# Altium schematic sheet Voltage Regulation.SchDoc
size A; DocumentNumber: 4; SheetNumber: 4; SheetTotal: 4
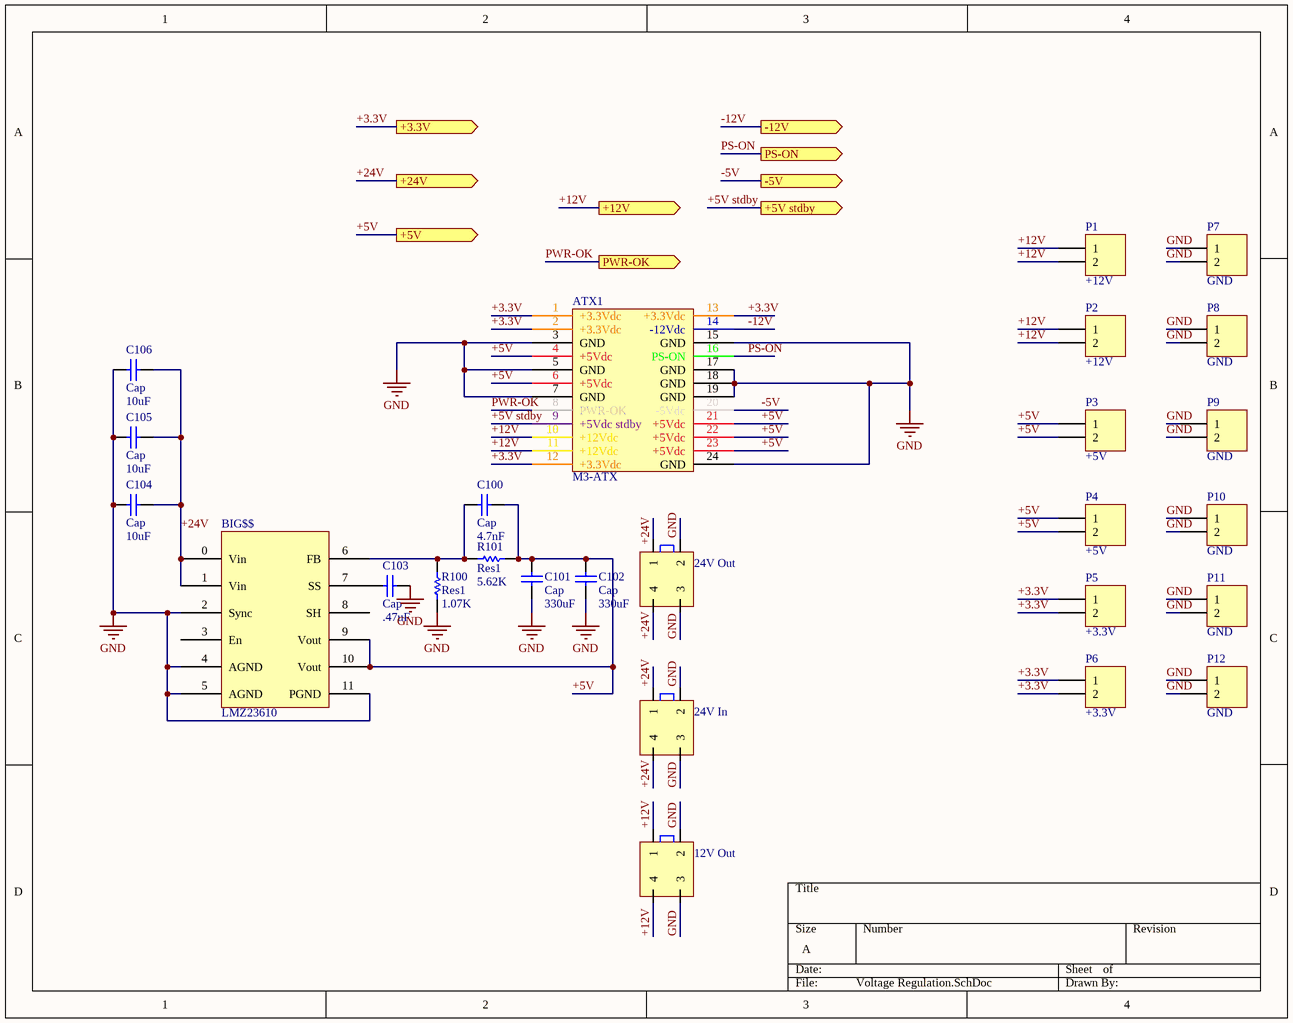
[diagram p0: Voltage Regulation.SchDoc]

## Parts
12V_Out  5566-4  [5566-4]  (value not drawn)
24V_In  5566-4  [5566-4]  (value not drawn)
24V_Out  5566-4  [5566-4]  (value not drawn)
ATX1  M3-ATX  [24-POS 5566]
BIG$$  LMZ23610  [LMZ23610]
C100  Cap  value 4.7nF  [RAD-0.3]
C101  Cap  value 330uF  [RAD-0.3]
C102  Cap  value 330uF  [RAD-0.3]
C103  Cap  value .47uF  [RAD-0.3]
C104  Cap  value 10uF  [RAD-0.3]
C105  Cap  value 10uF  [RAD-0.3]
C106  Cap  value 10uF  [RAD-0.3]
P1  +12V  [Male 2X1]
P2  +12V  [Male 2X1]
P3  +5V  [Male 2X1]
P4  +5V  [Male 2X1]
P5  +3.3V  [Male 2X1]
P6  +3.3V  [Male 2X1]
P7  GND  [Male 2X1]
P8  GND  [Male 2X1]
P9  GND  [Male 2X1]
P10  GND  [Male 2X1]
P11  GND  [Male 2X1]
P12  GND  [Male 2X1]
R100  Res1  value 1.07K  [AXIAL-0.3]
R101  Res1  value 5.62K  [AXIAL-0.3]

## Ports
+3.3V (out), +5V (out), +5V stdby (out), +12V (out), +24V (out), -5V (out), -12V (out), PS-ON (out), PWR-OK (out)

## Nets
GND: 12V_Out.2 12V_Out.3 24V_In.2 24V_In.3 24V_Out.2 24V_Out.3 ATX1.3(GND) ATX1.5(GND) ATX1.7(GND) ATX1.15(GND) ATX1.17(GND) ATX1.18(GND) ATX1.19(GND) ATX1.24(GND) BIG$$.2(Sync) BIG$$.4(AGND) BIG$$.5(AGND) BIG$$.11(PGND) C101.1 C102.1 C103.2 C104.1 C105.1 C106.1 P7.1 P7.2 P8.1 P8.2 P9.1 P9.2 P10.1 P10.2 P11.1 P11.2 P12.1 P12.2 R100.1
+3.3V: ATX1.1(+3.3Vdc) ATX1.2(+3.3Vdc) ATX1.12(+3.3Vdc) ATX1.13(+3.3Vdc) P5.1 P5.2 P6.1 P6.2 ; port +3.3V
+5V: ATX1.4(+5Vdc) ATX1.6(+5Vdc) ATX1.21(+5Vdc) ATX1.22(+5Vdc) ATX1.23(+5Vdc) BIG$$.9(Vout) BIG$$.10(Vout) C100.2 C101.2 C102.2 P3.1 P3.2 P4.1 P4.2 R101.2 ; port +5V
+5V stdby: ATX1.9(+5Vdc_stdby) ; port +5V stdby
+12V: 12V_Out.1 12V_Out.4 ATX1.10(+12Vdc) ATX1.11(+12Vdc) P1.1 P1.2 P2.1 P2.2 ; port +12V
+24V: 24V_In.1 24V_In.4 24V_Out.4 BIG$$.0(Vin) BIG$$.1(Vin) C104.2 C105.2 C106.2 ; port +24V
-5V: ATX1.20(-5Vdc) ; port -5V
-12V: ATX1.14(-12Vdc) ; port -12V
PS-ON: ATX1.16(PS-ON) ; port PS-ON
PWR-OK: ATX1.8(PWR-OK) ; port PWR-OK
NetBIG$$_6: BIG$$.6(FB) C100.1 R100.2 R101.1
NetBIG$$_7: BIG$$.7(SS) C103.1

Not connected (* = marked no-connect by the designer): 24V_Out 1; BIG$$ 3(En) 8(SH)

## Notes on the sheet
- Labels drawn without touching a wire or pin: +24V

## Library data of the parts
12V_Out 24V_In 24V_Out = 5566-4: 4.20mm (.165") Pitch Mini-Fit Jr.™ Header, Dual Row, Vertical, without Snap-in Plastic Peg PCB Lock, 4 Circuits, PA Polyamide Nylon 6/6 94V-2, Tin (Sn) Plating, without Drain Holes
ATX1 = 39-29-9244: ATX 24 pin connector; Digikey Part Number: WM7345-ND
C100-C106 = Cap: Capacitor; Published: 8-Jun-2000; LatestRevisionDate: 17-Jul-2002; LatestRevisionNote: Re-released for DXP Platform.; PackageReference: RAD-0.3; Publisher: Altium Limited; PackageDescription: Radial Cap, Thru-Hole; 2 Leads; 0.3 in Pin Spacing
P1-P12 = Header 2: Header, 2-Pin; LatestRevisionDate: 17-Jul-2002; LatestRevisionNote: Re-released for DXP Platform.; Publisher: Altium Limited
R100 R101 = Res1: Resistor; Published: 8-Jun-2000; LatestRevisionDate: 17-Jul-2002; LatestRevisionNote: Re-released for DXP Platform.; PackageReference: AXIAL-0.3; Publisher: Altium Limited; PackageDescription: Axial Device, Thru-Hole; 2 Leads; 0.3 in Pin Spacing